# Altium project Arena_Project.PrjPcb
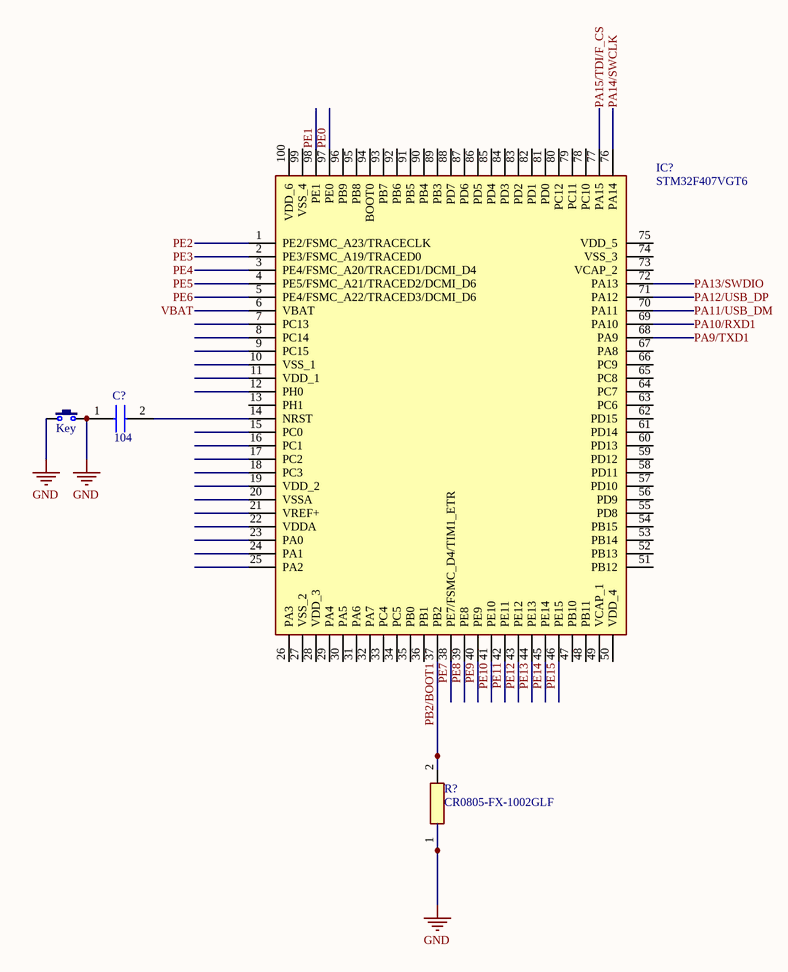
[diagram p0: controlPanel.SchDoc]
1 sheet, 4 parts. Net scope: global (net labels, ports and power ports of the same name join across sheets).
Board file: controlPanel.PcbDoc

## Sheet controlPanel.SchDoc
size A4

### Parts
C?  104  [CAPC1608X80N]
IC?  STM32F407VGT6  [QFP50P1600X1600X160-100N]
Key  3x6x5  [TSW SMD-3*6*2.5]  (value not drawn)
R?  CR0805-FX-1002GLF  [RESC2012X60N]

### Nets
GND: C?.1 Key.1 Key.2 R?.1
PA9/TXD1: IC?.68(PA9)
PA10/RXD1: IC?.69(PA10)
PA11/USB_DM: IC?.70(PA11)
PA12/USB_DP: IC?.71(PA12)
PA13/SWDIO: IC?.72(PA13)
PA14/SWCLK: IC?.76(PA14)
PA15/TDI/F_CS: IC?.77(PA15)
PB2/BOOT1: IC?.37(PB2) R?.2
PE0: IC?.97(PE0)
PE1: IC?.98(PE1)
PE2: IC?.1(PE2/FSMC_A23/TRACECLK)
PE3: IC?.2(PE3/FSMC_A19/TRACED0)
PE4: IC?.3(PE4/FSMC_A20/TRACED1/DCMI_D4)
PE5: IC?.4(PE5/FSMC_A21/TRACED2/DCMI_D6)
PE6: IC?.5(PE4/FSMC_A22/TRACED3/DCMI_D6)
PE7: IC?.38(PE7/FSMC_D4/TIM1_ETR)
PE8: IC?.39(PE8)
PE9: IC?.40(PE9)
PE10: IC?.41(PE10)
PE11: IC?.42(PE11)
PE12: IC?.43(PE12)
PE13: IC?.44(PE13)
PE14: IC?.45(PE14)
PE15: IC?.46(PE15)
VBAT: IC?.6(VBAT)
NetC?_2: C?.2 IC?.14(NRST)

Not connected (* = marked no-connect by the designer): IC? 7(PC13) 8(PC14) 9(PC15) 10(VSS_1) 11(VDD_1) 12(PH0) 13(PH1) 15(PC0) 16(PC1) 17(PC2) 18(PC3) 19(VDD_2) 20(VSSA) 21(VREF+) 22(VDDA) 23(PA0) 24(PA1) 25(PA2) 26(PA3) 27(VSS_2) 28(VDD_3) 29(PA4) 30(PA5) 31(PA6) 32(PA7) 33(PC4) 34(PC5) 35(PB0) 36(PB1) 47(PB10) 48(PB11) 49(VCAP_1) 50(VDD_4) 51(PB12) 52(PB13) 53(PB14) 54(PB15) 55(PD8) 56(PD9) 57(PD10) 58(PD11) 59(PD12) 60(PD13) 61(PD14) 62(PD15) 63(PC6) 64(PC7) 65(PC8) 66(PC9) 67(PA8) 73(VCAP_2) 74(VSS_3) 75(VDD_5) 78(PC10) 79(PC11) 80(PC12) 81(PD0) 82(PD1) 83(PD2) 84(PD3) 85(PD4) 86(PD5) 87(PD6) 88(PD7) 89(PB3) 90(PB4) 91(PB5) 92(PB6) 93(PB7) 94(BOOT0) 95(PB8) 96(PB9) 99(VSS_4) 100(VDD_6)

### Library data of the parts
C? = C1608X5R1H104K080DA: Capacitor; Manufacturer_Name: TDK; Datasheet Link: https://product.tdk.com/info/en/catalog/datasheets/mlcc_commercial_midvoltage_en.pdf; Height: 0.8mm; Manufacturer_Part_Number: C1608X5R1H104K080DA; Arrow Part Number: C1608X5R1H104K080DA; Arrow Price/Stock: https://www.arrow.com/en/products/c1608x5r1h104k080da/tdk
IC? = STM32F407VGT6: Integrated Circuit; Manufacturer_Name: STMicroelectronics; Datasheet Link: http://www.st.com/web/en/resource/technical/document/datasheet/DM00037051.pdf; Height: 1.6mm; Manufacturer_Part_Number: STM32F407VGT6; Mouser Part Number: 511-STM32F407VGT6; Mouser Price/Stock: https://www.mouser.co.uk/ProductDetail/STMicroelectronics/STM32F407VGT6?qs=Z8%252BeY1k3TIKAEQqwbO%2FOzA%3D%3D; Arrow Part Number: STM32F407VGT6; Arrow Price/Stock: https://www.arrow.com/en/products/stm32f407vgt6/stmicroelectronics?region=nac
Key = TSW 3x6: 3x6轻触开关; 免费技术支持，联系售后: 唯一出售店铺网址https://shop463601444.taobao.com; 封装库来自淘宝卖家 ID：黄晶宝石: 其他店铺购入均为盗版假冒封装库，请立即申请退款，本店3~10元现金奖励; BOM名称: 3x6轻触开关
R? = CR0805-FX-1002GLF: Resistor; Manufacturer_Name: Bourns; Datasheet Link: https://www.bourns.com/pdfs/chpreztr.pdf; Height: 0.6mm; Manufacturer_Part_Number: CR0805-FX-1002GLF; Mouser Part Number: 652-CR0805-FX1002GLF; Mouser Price/Stock: https://www.mouser.com/Search/Refine.aspx?Keyword=652-CR0805-FX1002GLF; Arrow Part Number: CR0805-FX-1002GLF; Arrow Price/Stock: https://www.arrow.com/en/products/cr0805-fx-1002glf/bourns